# Altium project FPSModule.PrjPcb
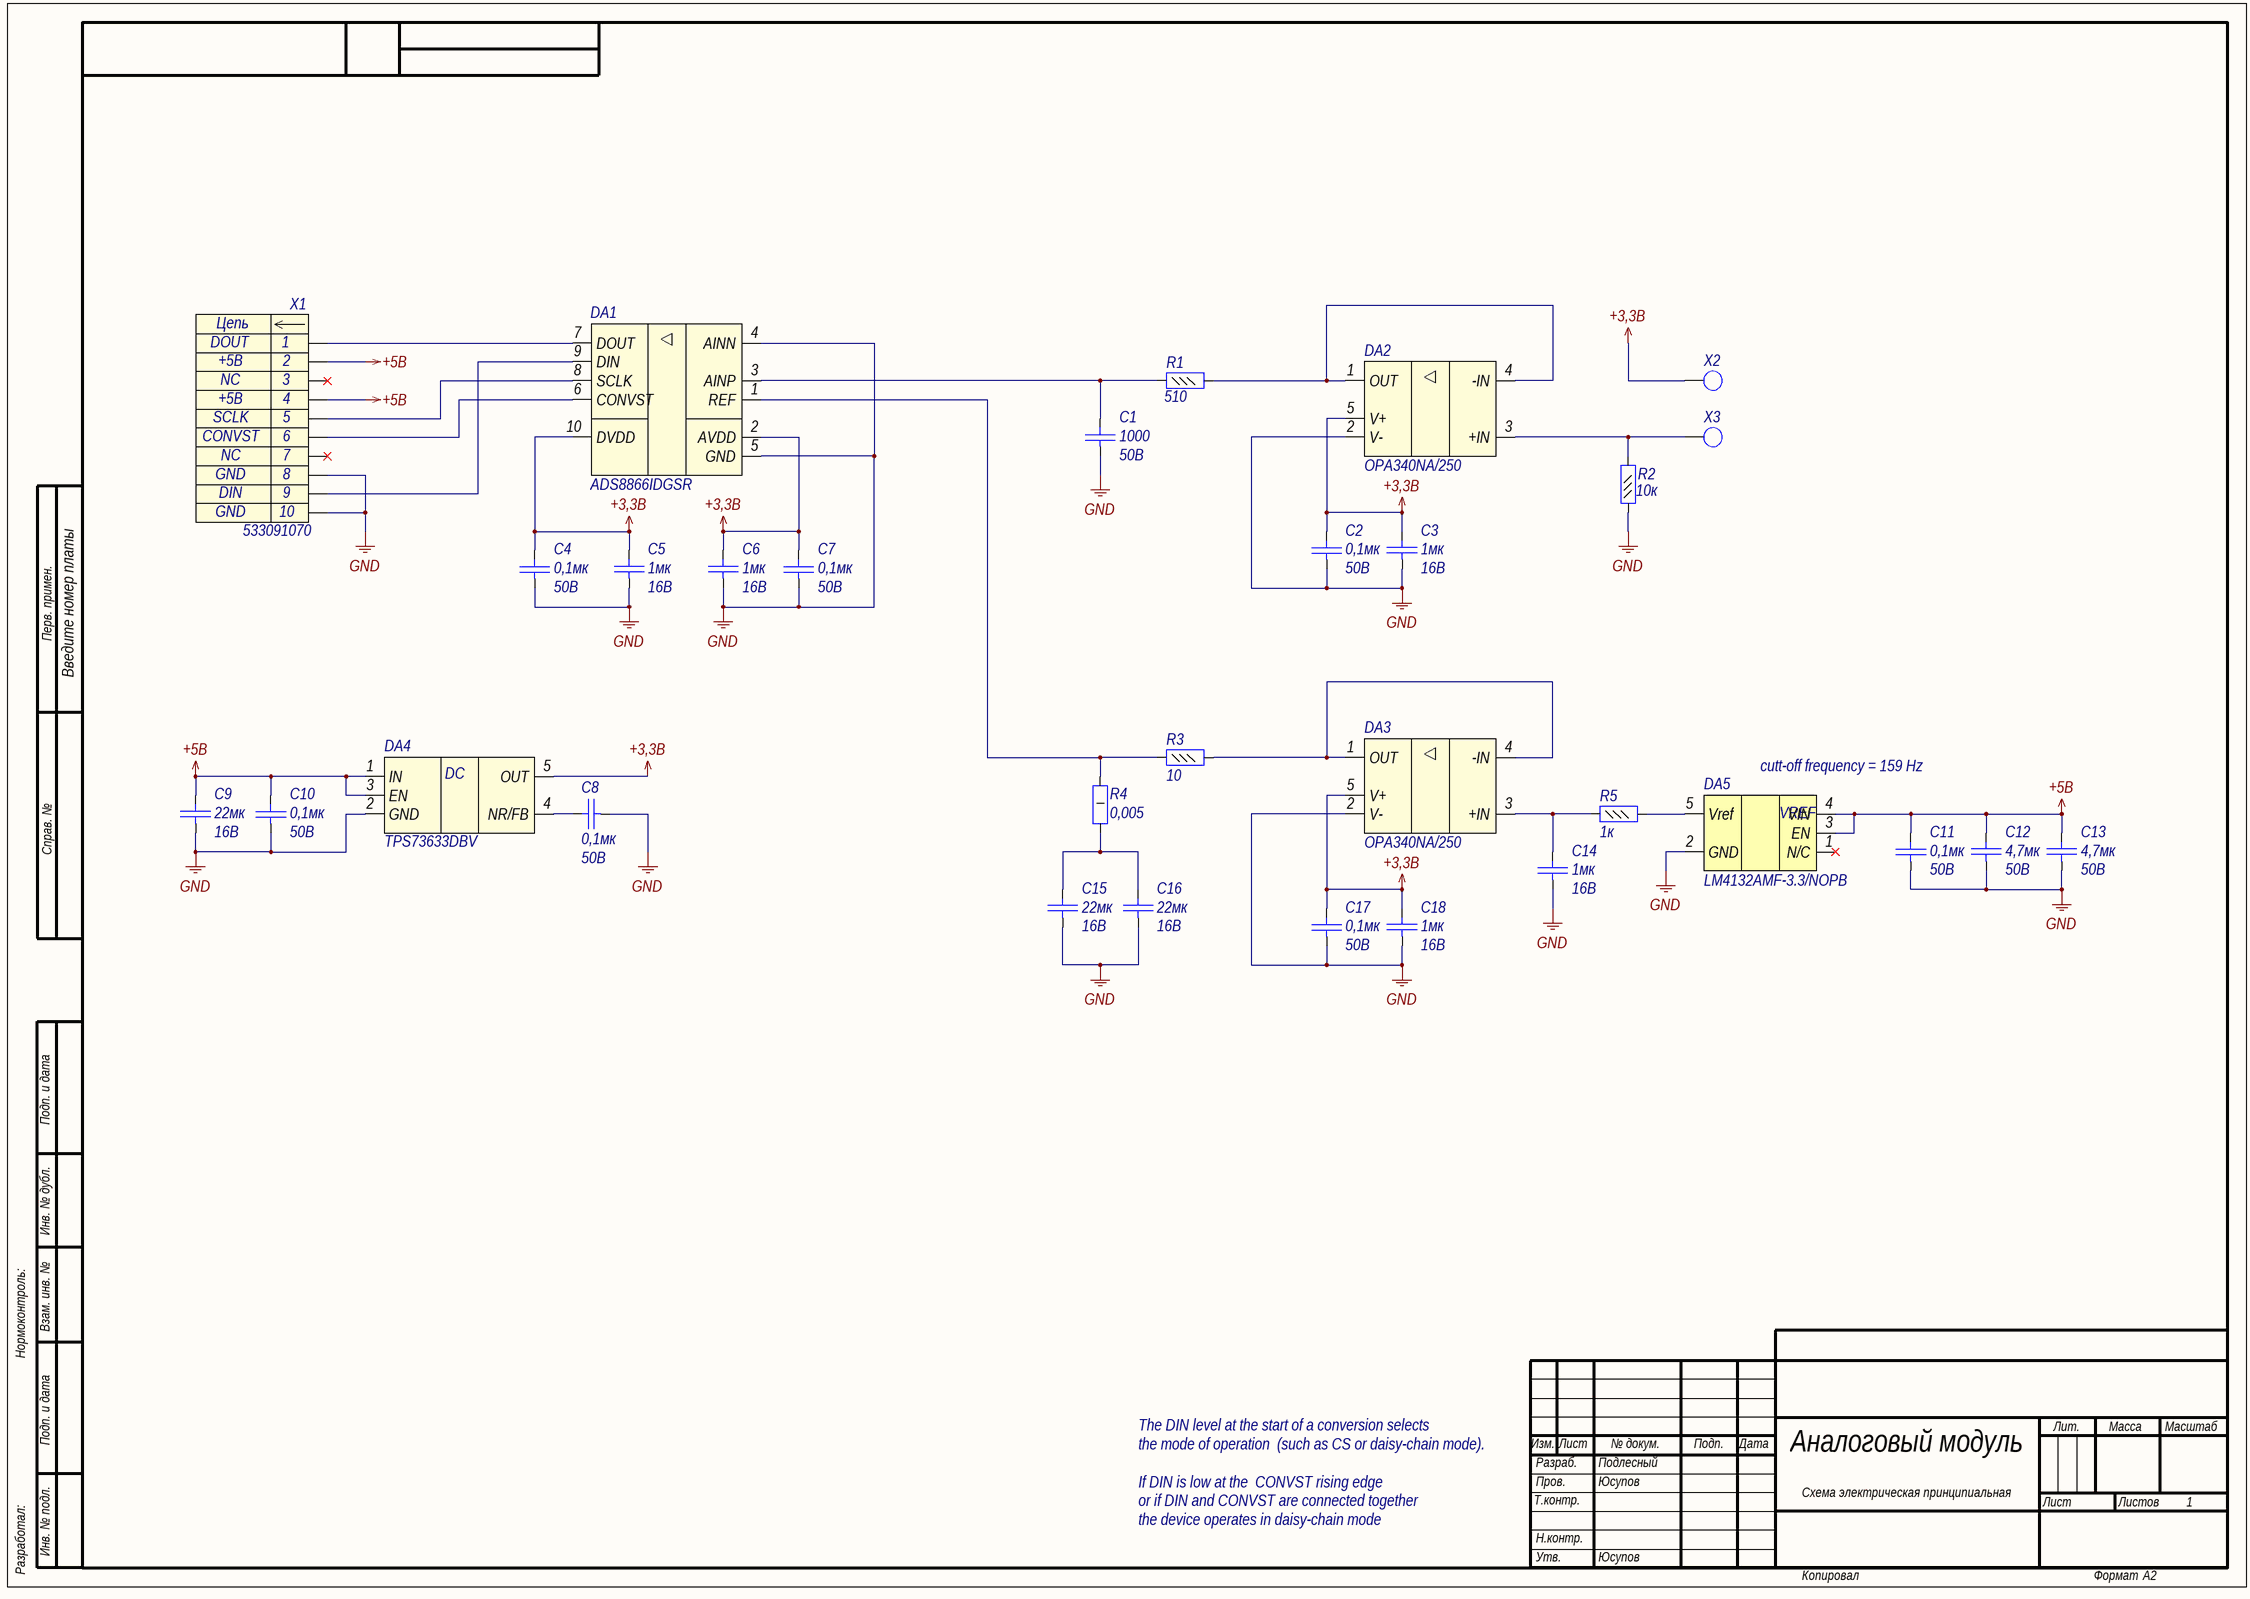
[diagram p0: FPSModule.SchDoc]
1 sheet, 31 parts. Net scope: global (net labels, ports and power ports of the same name join across sheets).
Board file: FPSModule.PcbDoc

## Sheet FPSModule.SchDoc: Аналоговый модуль
size 594 x 420 mm; ApprovedBy: Юсупов; CheckedBy: Юсупов; DrawnBy: Подлесный; SheetTotal: 1; Format: A2; DocumentType: Схема электрическая принципиальная; ImagePath: Введите номер платы

### Parts
C1  Voltage: 50B  [C0402]  (hidden comment: 1000)
C2  Voltage: 50В  [C0402]  (hidden comment: 0,1мк)
C3  Voltage: 16B  [C0603]  (hidden comment: 1мк)
C4  Voltage: 50В  [C0402]  (hidden comment: 0,1мк)
C5  Voltage: 16B  [C0603]  (hidden comment: 1мк)
C6  Voltage: 16B  [C0603]  (hidden comment: 1мк)
C7  Voltage: 50В  [C0402]  (hidden comment: 0,1мк)
C8  Voltage: 50В  [C0402]  (hidden comment: 0,1мк)
C9  Voltage: 16B  [C1210]  (hidden comment: 22мк)
C10  Voltage: 50В  [C0402]  (hidden comment: 0,1мк)
C11  Voltage: 50В  [C0402]  (hidden comment: 0,1мк)
C12  Voltage: 50В  [C0805]  (hidden comment: 4,7мк)
C13  Voltage: 50В  [C0805]  (hidden comment: 4,7мк)
C14  Voltage: 16B  [C0603]  (hidden comment: 1мк)
C15  Voltage: 16B  [C1210]  (hidden comment: 22мк)
C16  Voltage: 16B  [C1210]  (hidden comment: 22мк)
C17  Voltage: 50В  [C0402]  (hidden comment: 0,1мк)
C18  Voltage: 16B  [C0603]  (hidden comment: 1мк)
DA1  Part Number: ADS8866IDGSR  [MSOP10]  (hidden comment: ADS8866)
DA2  Part Number: OPA340NA/250  [SOT23-5]  (hidden comment: OPA340)
DA3  Part Number: OPA340NA/250  [SOT23-5]  (hidden comment: OPA340)
DA4  Part Number: TPS73633DBV  [SOT23-5]  (hidden comment: TPS736DBV)
DA5  Part Number: LM4132AMF-3.3/NOPB  [SOT23-5]  (hidden comment: LM4132)
R1  value 510  [R0402]  (hidden comment: Resistor_0,062Вт)
R2  value 10к  [R0402]  (hidden comment: Resistor_0,062Вт)
R3  value 10  [R0402]  (hidden comment: Resistor_0,062Вт)
R4  value 0,005  [R1206]  (hidden comment: Resistor_1Вт)
R5  value 1к  [R0402]  (hidden comment: Resistor_0,062Вт)
X1  Part Number: 533091070  [SlimStack-10pin-angl-plg]  (hidden comment: Header_10_plg)
X2  SoldPoint  [SOLD_1PAD]  (value not drawn)
X3  SoldPoint  [SOLD_1PAD]  (value not drawn)

### Nets
+3,3B: C2.2 C3.2 C4.2 C5.2 C6.2 C7.2 C17.2 C18.2 DA1.2(AVDD) DA1.10(DVDD) DA2.5(V+) DA3.5(V+) DA4.5(OUT) X2.1
+5B: C9.2 C10.2 C11.2 C12.2 C13.2 DA4.1(IN) DA4.3(EN) DA5.3(EN) DA5.4(VIN) X1.2 X1.4
GND: C1.1 C2.1 C3.1 C4.1 C5.1 C6.1 C7.1 C8.1 C9.1 C10.1 C11.1 C12.1 C13.1 C14.1 C15.1 C16.1 C17.1 C18.1 DA1.4(AINN) DA1.5(GND) DA2.2(V-) DA3.2(V-) DA4.2(GND) DA5.2(GND) R2.1 X1.8 X1.10
NetC1_2: C1.2 DA1.3(AINP) R1.1
NetC8_2: C8.2 DA4.4(NR/FB)
NetC14_2: C14.2 DA3.3(+IN) R5.1
NetC15_2: C15.2 C16.2 R4.1
NetDA1_1: DA1.1(REF) R3.1 R4.2
NetDA1_6: DA1.6(CONVST) X1.6
NetDA1_7: DA1.7(DOUT) X1.1
NetDA1_8: DA1.8(SCLK) X1.5
NetDA1_9: DA1.9(DIN) X1.9
NetDA2_1: DA2.1(OUT) DA2.4(-IN) R1.2
NetDA2_3: DA2.3(+IN) R2.2 X3.1
NetDA3_1: DA3.1(OUT) DA3.4(-IN) R3.2
NetDA5_5: DA5.5(Vref) R5.2

Not connected (* = marked no-connect by the designer): DA5 1(N/C)*; X1 3* 7*

### Notes on the sheet
- Перв. примен.
- cutt-off frequency = 159 Hz
- Справ. №
- Подп. и дата
- Инв. № дубл.
- Нормоконтроль:
- Взам. инв. №
- The DIN level at the start of a conversion selects
- the mode of operation  (such as CS or daisy-chain mode).
- Изм.
- Лист
- № докум.
- Подп.
- Дата
- Лит.
- Масса
- Масштаб
- If DIN is low at the  CONVST rising edge
- or if DIN and CONVST are connected together
- Т.контр.
- Пров.
- Разраб.
- Листов
- Разработал:
- Инв. № подл.
- the device operates in daisy-chain mode
- Н.контр.
- Утв.
- Копировал
- Формат
- (in symbol connect227) Цепь
- (in symbol LM4132AMF-3.3/NOPB) VREF
- (in symbol pwr113) DC

### Library data of the parts
C1 = cap28: Конденсатор; Part Name: Ceramic; Manufacture: Murata; Part Number: GRM1555C1H102J; id: cap28; TKE: NP0; Value: 1000
C2 C4 C7 C8 C10 C11 C17 = cap277: Конденсатор; Part Name: Ceramic; Manufacture: Murata; Part Number: GRM155R71H104KE14D; id: cap277; TKE: X7R; tga: 0,10%; Value: 0,1мк
C3 C5 C6 C14 C18 = cap133: Конденсатор; Part Name: Ceramic; Manufacture: Murata; Part Number: GRM188R71C105KA12D**; id: cap133; TKE: X7R; Value: 1мк
C9 C15 C16 = cap294: Конденсатор; Part Name: MLCC; Manufacture: TDK; Part Number: C3225X7R1C226M; id: cap294; TKE: X7R; tga: 0,20%; Value: 22мк
C12 C13 = cap224: Конденсатор; Part Name: Ceramic; Manufacture: Murata; Part Number: GRM21BZ71H475KE15L; id: cap224; TKE: X7R; Value: 4,7мк
DA1 = ADS8866IDGSR: 100-kSPS, serial interface, micropower, miniature,  single-ended input, SAR; Part Name: SAR analog-to-digital converter; Manufacture: Texas Instruments; id: adc4; Interface: SPI; Resolution: 16bit; Sample frequence: 100 kS/s; Channels: 1; Type Supply: Single Polar; Current Consumption: 50nA; Power Supply: 2.7-3.6V; ADC: SAR; Input channel: Single-Ended
DA2 DA3 = amp23: Operational Amplifiers / MicroAmplifier; Manufacture: Texas Instruments; id: amp23; Rail-to-rail: yes; Supply Voltage: 2,7-5,5B; Supply Current max: 0,75mA; Bandwidth: 5,5MHz; Input Bias Current: 0,2pA; CMRR: 80dB; PSRR: 100dB; Offset voltage: 150uB; Channels: 1; Part Name: Operational Amplifiers MicroAmplifier
DA4 = pwr113: 400-mA Low-Dropout Regulator with Reverse Current  Protection; Manufacturer: Texas Instruments; id: pwr113; Input Voltage: 1,7-5,5В; Output Voltage: 3,3B; Dropout Voltage: 75mB; Current: 400mA; Part Name: Low-Dropout Regulator with Reverse Current Protection; Type: Linear
DA5 = LM4132AMF-3.3/NOPB: Precision Low Dropout Voltage Reference; Manufacturer: Texas Instruments; id: ref4; Voltage min stabilize: 3,3B; Max input voltage: 5,5B; Accuracy: 0,0005; Working current: 60uA; Output current: 20mA; Part Name: Precision Low Dropout Voltage Reference
R1 = res263: Резистор; Manufacture: Yageo; Part Number: RC0402FR-07510RL; id: res263; Accuracy: 0,01; Part Name: Resistor; Power: 0,062Вт
R2 = res294: Резистор; Manufacture: Yageo; Part Number: RC0402FR-0710KL; id: res294; Accuracy: 0,01; Part Name: Resistor; Power: 0,062Вт
R3 = res222: Резистор; Manufacture: Yageo; Part Number: RC0402FR-0710RL; id: res222; Accuracy: 0,01; Part Name: Resistor; Power: 0,062Вт
R4 = res1314: Резистор; Manufacture: Stackpole Electronics Inc; Part Number: CSRF1206FT5L00; Accuracy: 0,01; Power: 1Вт; id: res1314; Part Name: Resistor
R5 = res270: Резистор; Manufacture: Yageo; Part Number: RC0402FR-071KL; id: res270; Accuracy: 0,01; Part Name: Resistor; Power: 0,062Вт
X1 = connect227: Разъем - 10 конт. вилка; Part Name: SlimStack Board-to-Board plug; Manufacture: Molex; Contact_1: DOUT; Contact_2: +5B; Contact_3: NC; Contact_5: SCLK; Contact_6: CONVST; Etch: 0.8mm; Contact_8: GND; Contact_9: DIN; System: Connector; Contact_4: +5B; id: connect227; Contact_7: NC; Contact_10: GND
X2 X3 = connect220: Part Name: Пады на запайку; Contact_1: Contact_1; id: connect220